# EasyEDA Pro project ProPrj_FOC一体化驱动控制板-L6234_2025-07-28.epro

# Schematic Schematic1
Board Name: Board1; Create Date: 2025-06-25; Page Name: P1; Project Name: FOC一体化驱动控制板-L6234; Schematic Name: Schematic1; Update Date: 2025-06-26; Company: 嘉立创EDA; Page Size: A4; Version: V1.0
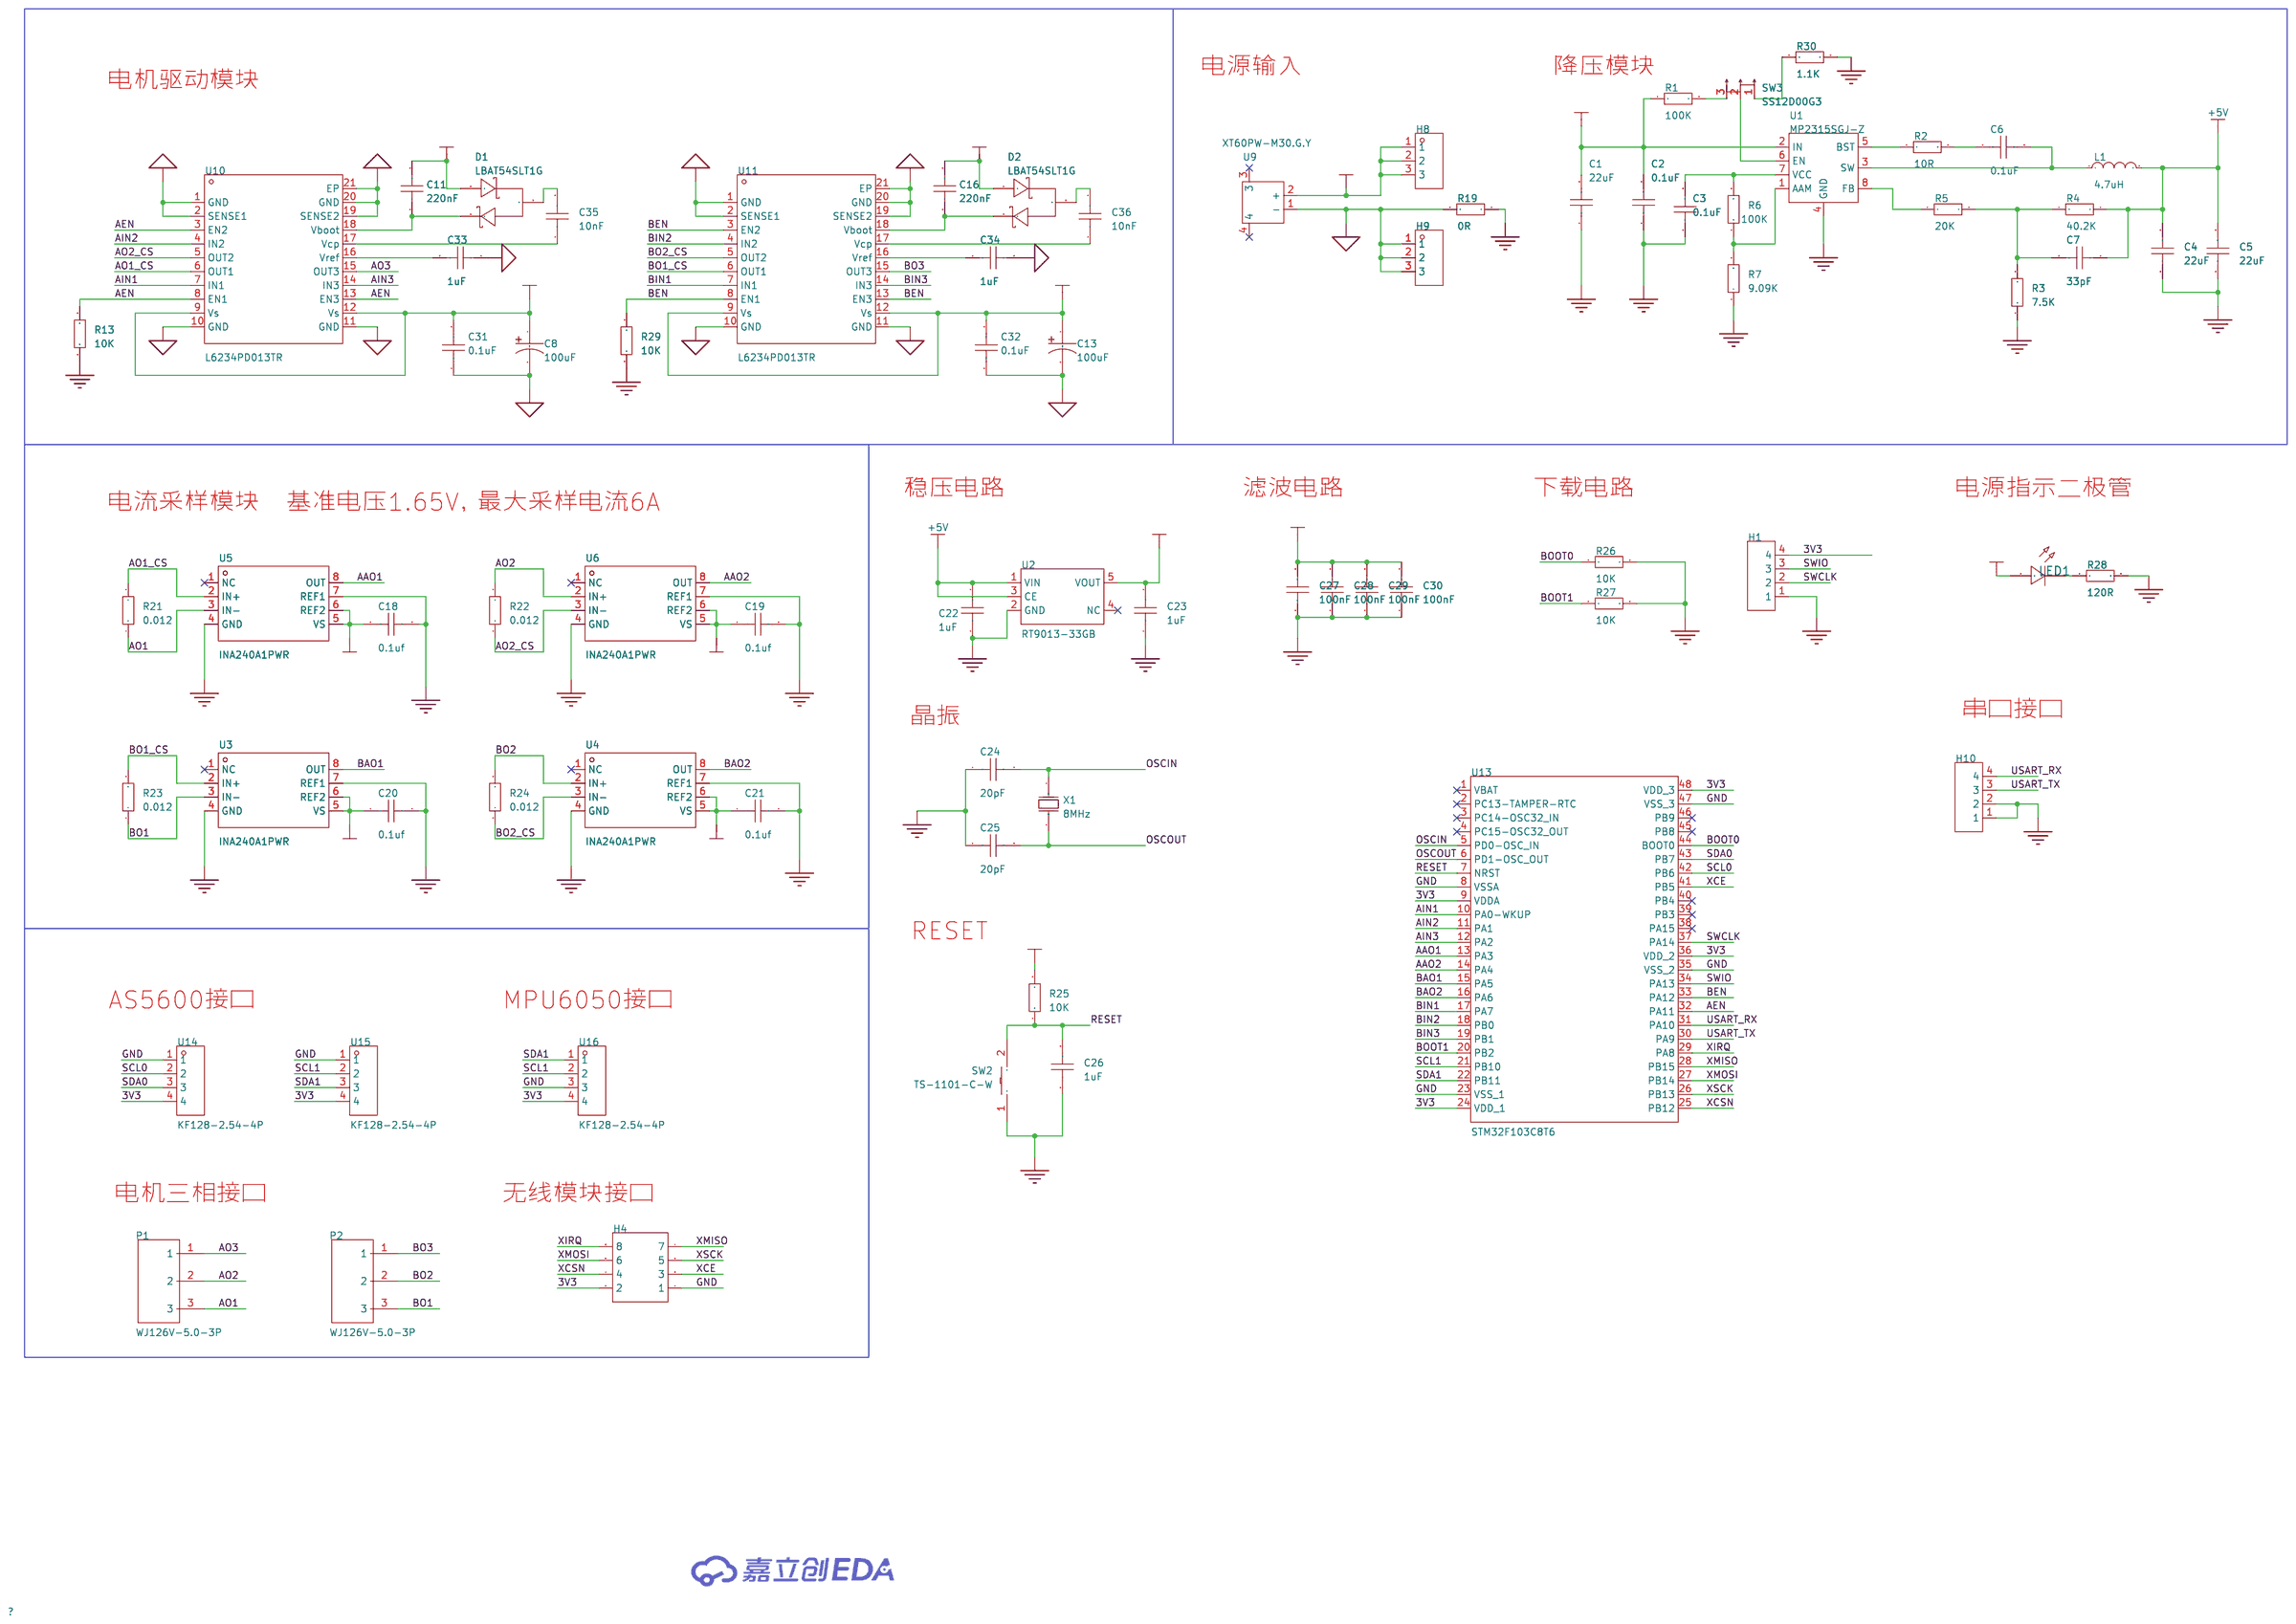
[diagram p0: schematic sheet]

## Parts
C1  22uF  [C1206]
C2  0.1uF  [C0603]
C3  0.1uF  [C0603]
C4  22uF  [C0805]
C5  22uF  [C0805]
C6  0.1uF  [C0603]
C7  33pF  [C0603]
C8  100uF  [CAP-SMD_BD6.3-L6.6-W6.6-FD]
C11  220nF  [C0805]
C13  100uF  [CAP-SMD_BD6.3-L6.6-W6.6-FD]
C16  220nF  [C0805]
C18  0.1uf  [C0603]
C19  0.1uf  [C0603]
C20  0.1uf  [C0603]
C21  0.1uf  [C0603]
C22  1uF  [C0603]
C23  1uF  [C0603]
C24  20pF  [C0603]
C25  20pF  [C0603]
C26  1uF  [C0603]
C27  100nF  [C0603]
C28  100nF  [C0603]
C29  100nF  [C0603]
C30  100nF  [C0603]
C31  0.1uF  [C0603]
C32  0.1uF  [C0603]
C33  1uF  [C0603]
C34  1uF  [C0603]
C35  10nF  [C0603]
C36  10nF  [C0603]
D1  LBAT54SLT1G  [SOT-23_L2.9-W1.3-P1.90-LS2.4-BR]
D2  LBAT54SLT1G  [SOT-23_L2.9-W1.3-P1.90-LS2.4-BR]
H1  -  [HDR-TH_4P-P2.54-V-M]
H4  -  [HDR-TH_8P-P2.54-V-F-R2-C4-S2.54-1]
H8  -  [HDR-TH_3P-P2.54-V-M]
H9  -  [HDR-TH_3P-P2.54-V-M]
H10  -  [HDR-TH_4P-P2.54-V-M]
L1  4.7uH  [IND-SMD_L7.3-W6.6]
LED1  -  [LED_0603]
P1  WJ126V-5.0-3P  [CONN-TH_3P-P5.00_WJ126V-5.0-3P]
P2  WJ126V-5.0-3P  [CONN-TH_3P-P5.00_WJ126V-5.0-3P]
R1  100K  [R0603]
R2  10R  [R0603]
R3  7.5K  [R0603]
R4  40.2K  [R0603]
R5  20K  [R0603]
R6  100K  [R0603]
R7  9.09K  [R0603]
R13  10K  [R0603]
R19  0R  [R0805]
R21  0.012  [R0805]
R22  0.012  [R0805]
R23  0.012  [R0805]
R24  0.012  [R0805]
R25  10K  [R0603]
R26  10K  [R0603]
R27  10K  [R0603]
R28  120R  [R0603]
R29  10K  [R0603]
R30  1.1K  [R0603]
SW2  TS-1101-C-W  [SW-SMD_L6.0-W3.3-LS8.0]
SW3  SS12D00G3  [SW-TH_SS-12D01-GX]
U1  MP2315SGJ-Z  [TSOT-23-8_L2.9-W1.6-P0.65-LS2.8-BL]
U2  RT9013-33GB  [SOT-23-5_L2.9-W1.6-P0.95-LS2.8-BR]
U3  INA240A1PWR  [TSSOP-8_L4.4-W3.0-P0.65-LS6.4-BL]
U4  INA240A1PWR  [TSSOP-8_L4.4-W3.0-P0.65-LS6.4-BL]
U5  INA240A1PWR  [TSSOP-8_L4.4-W3.0-P0.65-LS6.4-BL]
U6  INA240A1PWR  [TSSOP-8_L4.4-W3.0-P0.65-LS6.4-BL]
U9  XT60PW-M30.G.Y  [CONN-TH_XT60PW-M]
U10  L6234PD013TR  [POWERSO20_L15.9-W11.0-P1.27-LS14.2-BL-EP]
U11  L6234PD013TR  [POWERSO20_L15.9-W11.0-P1.27-LS14.2-BL-EP]
U13  STM32F103C8T6  [LQFP-48_L7.0-W7.0-P0.50-LS9.0-BL]
U14  KF128-2.54-4P  [CONN-TH_4P-P2.54_KF128-2.54-4P]
U15  KF128-2.54-4P  [CONN-TH_4P-P2.54_KF128-2.54-4P]
U16  KF128-2.54-4P  [CONN-TH_4P-P2.54_KF128-2.54-4P]
X1  8MHz  [OSC-TH_L10.0-W4.5-P5.00]

## Library data of the parts
C1 = CGA1206X5R226M350NT: 容值:22uF;精度:±20%;额定电压:35V;温度系数:X5R;; LCSC Part Name: 22uF ±20% 35V; Supplier Part: C6119969; Manufacturer: HRE(芯声); Supplier Footprint: 1206; JLCPCB Part Class: Extended Part; Supplier: LCSC; Tolerance: ±20%; Voltage Rating: 35V; Temperature Coefficient: X5R
C2 C3 C6 C7 C18-C36 = CAP_0603: Supplier Footprint: 0603
C4 C5 = CGA0805X5R226M350MT: 容值:22uF;精度:±20%;额定电压:35V;材质(温度系数):X5R;; LCSC Part Name: 22uF ±20% 35V; Supplier Part: C6119901; Manufacturer: HRE(芯声); Supplier Footprint: 0805; JLCPCB Part Class: Extended Part; Datasheet: https://atta.szlcsc.com/upload/public/pdf/source/20231129/D589D0CC4D260F7AC3A77E53B455CCB3.pdf; Supplier: LCSC; Tolerance: ±20%; Voltage Rated: 35V; Temperature Coefficient: X5R
C8 C13 = RVE1V101M0607: 容值:100uF;精度:±20%;额定电压:35V;纹波电流:-;等效串联电阻:-;; LCSC Part Name: 100uF ±20% 35V; Supplier Part: C88675; Manufacturer: HONOR(荣誉); Supplier Footprint: SMD,D6.3xL7.7mm; JLCPCB Part Class: 扩展库; Datasheet: https://atta.szlcsc.com/upload/public/pdf/source/20180326/C88681_F49340D40E14C975B06CFC1ADD63F7A4.pdf; Supplier: LCSC; Tolerance: ±20%; Rated Voltage: 35V; φD: 6.3mm; L: 7.7mm; Lifetime @ Temp: 2000hrs@105℃; Operating Temperature: -55℃~+105℃
C11 C16 = CAP_0805: Supplier Footprint: 0805
D1 D2 = LBAT54SLT1G: 正向压降(Vf):400mV;直流反向耐压(Vr):30V;整流电流:200mA;; LCSC Part Name: 电压:30V 电流:200mA; Supplier Part: C12765; Manufacturer: LRC(乐山无线电); Supplier Footprint: SOT-23; JLCPCB Part Class: 扩展库; Datasheet: https://atta.szlcsc.com/upload/public/pdf/source/20130604/1457706606553.pdf; Supplier: LCSC; Voltage - Forward(Vf@If): 400mV; Voltage - DC Reverse(Vr): 30V; Current - Rectified: 200mA; Reverse Leakage Current (Ir): 2uA
H1 H10 = HDR-M_2.54_1x4P: Supplier Part: C492403; Supplier Footprint: 插件
H4 = HDR-F_2.54_2x4: Supplier Part: C92271; Supplier Footprint: 插件; JLCPCB Part Class: 扩展库
H8 H9 = HDR-M_2.54_1x3P: Supplier Part: C2937625; Supplier Footprint: 插件
L1 = MCS0630-4R7MPY1: 电感值:4.7uH;精度:±20%;额定电流:5.5A;饱和电流(Isat):7A;; LCSC Part Name: 4.7uH ±20% 7A; Supplier Part: C2937097; Manufacturer: PSA(信昌电陶); Supplier Footprint: 0630; JLCPCB Part Class: 扩展库; Datasheet: https://atta.szlcsc.com/upload/public/pdf/source/20220121/EA6E6E6F70ED7BAE67EC293805EAAACB.pdf; Supplier: LCSC; Tolerance: ±20%; Rated Current: 5.5A; Saturation Current (Isat): 7A; DC Resistance (DCR): 37mΩ
LED1 = LED_0603-R: Supplier Footprint: 0603
P1 P2 = WJ126V-5.0-3P: 结构:1x3P;间距:5mm;颜色:绿色;安装方式:直插;额定电流:18A;额定电压:250V;排数:1;线规 - AWG:14~26;线规 - 平方毫米:2.5;每排PIN数:3;工作温度范围:-40℃~+105℃;; LCSC Part Name: 5mm 1x3P 排数:1 每排P数:3 直插; Supplier Part: C8401; Manufacturer: KANGNEX(康奈克斯电气); Supplier Footprint: 插件,P=5mm; JLCPCB Part Class: 扩展库; Datasheet: https://atta.szlcsc.com/upload/public/pdf/source/20191225/C8401_BC4AEF85CCBF7CDF5CCE64583ADD1E63.pdf; Supplier: LCSC; Structure: 1x3P; Pitch: 5mm; Color: 绿色; Mounting Style: 直插; Current Rating (Max): 18A; Voltage Rating (Max): 250V; Number of Pins: 3P; Number of Rows: 1; Wire Gauge - AWG: 14~26; Wire Gauge - mm2: 2.5; Number of PINs Per Row: 3; Operating Temperature Range: -40℃~+105℃
R1-R7 R13 R25-R30 = Res_0603: Supplier Footprint: 0603
R19 R21-R24 = Res_0805: Supplier Footprint: 0805
SW2 = TS-1101-C-W: 电路结构:单刀单掷;按钮形状:矩形按钮;作用力:260gf;安装方式:立贴;开关长度:6mm;开关宽度:3.6mm;开关高度:2.5mm;带支架:不带;触点电流:50mA;额定电压(AC):-;额定电压(DC):12V;额定功率:-;绝缘电阻:-;带灯:无;机械寿命:5万次;; LCSC Part Name: 6*3.6*2.5mm 立贴 轻触开关; Supplier Part: C318938; Manufacturer: XKB Connectivity(中国星坤); Supplier Footprint: SMD; JLCPCB Part Class: 扩展库; Datasheet: https://atta.szlcsc.com/upload/public/pdf/source/20200227/C318938_C2E53B1EEDE37D980A33616AC086DE53.pdf; Supplier: LCSC; Circuit: 单刀单掷; Actuator Style: 矩形按钮; Operating Force: 260gf; Mounting Style: 立贴; Switch Length: 6mm; Switch Width: 3.6mm; Switch Height: 2.5mm; Strike Gundam: 不带; Contact Current: 50mA; Voltage Rating (DC): 12V; Actuator/Cap Color: 白色带淡绿; With Lamp: 无; Mechanical Life: 5万次; Operating Temperature: -30℃~+85℃
SW3 = SS12D00G3: Supplier Part: C9900018735; Supplier Footprint: SW-TH; JLCPCB Part Class: 扩展库; Supplier: LCSC
U1 = MP2315SGJ-Z: 功能类型:降压型;输出类型:固定;工作电压:4.5V~24V;输出电压:800mV~22.8V;输出电流:3A;; LCSC Part Name: 3A、24V、500kHz高效同步降压转换器; Supplier Part: C3031493; Manufacturer: MPS(芯源); Supplier Footprint: TSOT-23-8; JLCPCB Part Class: 扩展库; Datasheet: https://atta.szlcsc.com/upload/public/pdf/source/20250306/6947E43CF096EA5EF0087E1884EF0D8F.pdf; Supplier: LCSC; Function: 降压型; Output Type: 固定; Voltage - Supply: 4.5V~24V; Output Voltage: 800mV~22.8V; Output Current: 3A; Frequency - Switching: 500kHz; Operating Temperature: -40℃~+125℃; Synchronous Rectifier: 是; Number of Outputs: 1; Topology: 降压式; Quiescent Current: 120uA; Switch tube (built-in/external): 内置
U2 = RT9013-33GB_C19268157: 输出类型:固定;工作电压:7V;输出电压:3.3V;输出电流:500mA;电源纹波抑制比(PSRR):-;输出极性:正极;; Supplier Part: C19268157; Manufacturer: TECH PUBLIC(台舟); Supplier Footprint: SOT-23-5; JLCPCB Part Class: 扩展库; Datasheet: https://atta.szlcsc.com/upload/public/pdf/source/20231201/9D78CA17020D67EC103F1AC7C29CF260.pdf; Supplier: LCSC; Output Type: 固定; Voltage - Supply: 7V; Output Voltage: 3.3V; Output Current: 500mA; Operating Temperature: -40℃~+85℃@(Ta); Output Configuration: 正极; Number of Outputs: 1
U3-U6 = INA240A2PWR: 放大器数:单路;; Supplier Part: C129949; Manufacturer: TI(德州仪器); Supplier Footprint: TSSOP-8; JLCPCB Part Class: 扩展库; Datasheet: https://www.ti.com/cn/lit/gpn/ina240; Supplier: LCSC; Number of Channels: 单路; Supply Current: 1.8mA; Operating Temperature: -40℃~+125℃
U9 = XT60PW-M30.G.Y: Supplier Part: C7204007; Supplier Footprint: 插件; JLCPCB Part Class: 扩展库; Supplier: LCSC
U10 U11 = L6234PD013TR: 三相电机驱动器; LCSC Part Name: 4A 无刷直流BLDC电机驱动芯片 52V; Supplier Part: C77581; Manufacturer: ST(意法半导体); Supplier Footprint: SOIC-20-EP-11mm; JLCPCB Part Class: 扩展库; Datasheet: https://atta.szlcsc.com/upload/public/pdf/source/20160702/1467448307879.pdf; Supplier: LCSC
U13 = STM32F103C8T6: CPU内核:ARM-M3;CPU最大主频:72MHz;应用领域:-;; LCSC Part Name: 主流增强型ARM Cortex-M3 MCU，具有64 KB Flash、72 MHz CPU、电机控制、USB和CAN; Supplier Part: C8734; Manufacturer: ST(意法半导体); Supplier Footprint: LQFP-48(7x7); JLCPCB Part Class: 扩展库; Datasheet: https://atta.szlcsc.com/upload/public/pdf/source/20220812/8363ACEC51AD55ECEB84799464F7CB85.pdf; Supplier: LCSC; CPU Core: ARM-M3; CPU Maximum Speed: 72MHz; Program Storage Size: 64KB; Program Memory Type: FLASH; Number of I/O: 37; ADC (Bit): 12bit; Low Voltage Detection Threshold: 2V~3.6V
U14-U16 = KF128-2.54-4P: 结构:1x4P;间距:2.54mm;颜色:绿色;安装方式:直插;额定电流:8A;额定电压:130V;排数:1;线规 - AWG:18~26;线规 - 平方毫米:1;每排PIN数:4;工作温度范围:-40℃~+105℃;; LCSC Part Name: 2.54mm 1x4P 排数:1 每排P数:4 直插; Supplier Part: C474922; Manufacturer: KEFA(科发); Supplier Footprint: 插件,P=2.54mm; JLCPCB Part Class: 扩展库; Datasheet: https://atta.szlcsc.com/upload/public/pdf/source/20230317/0E5ECA9DB49110BC3219D12632CEA6EE.pdf; Supplier: LCSC; Structure: 1x4P; Pitch: 2.54mm; Color: 绿色; Mounting Style: 直插; Current Rating (Max): 8A; Voltage Rating (Max): 130V; Number of Pins: 4P; Number of Rows: 1; Wire Gauge - AWG: 18~26; Wire Gauge - mm2: 1; Number of PINs Per Row: 4; Operating Temperature Range: -40℃~+105℃
X1 = X49SD8MSD2SC: 晶振类型:直插晶振;频率:8MHz;常温频差:±20ppm;负载电容:20pF;频率稳定度:±30ppm;; LCSC Part Name: 8MHz ±20ppm 20pF; Supplier Part: C21263; Manufacturer: YXC(扬兴晶振); Supplier Footprint: HC-49S; JLCPCB Part Class: Extended Part; Datasheet: https://atta.szlcsc.com/upload/public/pdf/source/20240329/977D7F2434F98B2BE33270BB9FF3D86D.pdf; Supplier: LCSC; Type: 直插晶振; Normal temperature Frequency Tolerance: ±20ppm; Load Capacitance: 20pF; Frequency Stability: ±30ppm; Operating Temperature: -20℃~+70℃

## Nets
3V3: C18.1 C19.1 C20.1 C21.1 C23.2 C27.2 C28.2 C29.2 C30.2 H1.4 H4.2 LED1.2(A) R25.2 U2.5(VOUT) U3.5(VS) U3.6(REF2) U4.5(VS) U4.6(REF2) U5.5(VS) U5.6(REF2) U6.5(VS) U6.6(REF2) U13.9(VDDA) U13.24(VDD_1) U13.36(VDD_2) U13.48(VDD_3) U14.4 U15.4 U16.4
+5V: C4.2 C5.2 C7.2 C22.2 L1.2 R4.2 U2.1(VIN) U2.3(CE)
AGND: C8.2 C13.2 C31.1 C32.1 C33.1 C34.1 H9.1 H9.2 H9.3 R19.2 U9.1(-) U10.1(GND) U10.2(SENSE1) U10.10(GND) U10.11(GND) U10.19(SENSE2) U10.20(GND) U10.21(EP) U11.1(GND) U11.2(SENSE1) U11.10(GND) U11.11(GND) U11.19(SENSE2) U11.20(GND) U11.21(EP)
GND: C1.1 C2.1 C3.1 C4.1 C5.1 C18.2 C19.2 C20.2 C21.2 C22.1 C23.1 C24.1 C25.1 C26.1 C27.1 C28.1 C29.1 C30.1 H1.1 H4.1 H10.1 H10.2 R3.1 R7.1 R13.1 R19.1 R26.2 R27.2 R28.2 R29.1 R30.2 SW2.1 U1.4(GND) U2.2(GND) U3.4(GND) U3.7(REF1) U4.4(GND) U4.7(REF1) U5.4(GND) U5.7(REF1) U6.4(GND) U6.7(REF1) U13.8(VSSA) U13.23(VSS_1) U13.35(VSS_2) U13.47(VSS_3) U14.1 U15.1 U16.3
VIN: C1.2 C2.2 C8.1 C11.2 C13.1 C16.2 C31.2 C32.2 D1.1(A) D2.1(A) H8.1 H8.2 H8.3 R1.1 U1.2(IN) U9.2(+) U10.9(Vs) U10.12(Vs) U11.9(Vs) U11.12(Vs)
AAO1: U5.8(OUT) U13.13(PA3)
AAO2: U6.8(OUT) U13.14(PA4)
AEN: R13.2 U10.3(EN2) U10.8(EN1) U10.13(EN3) U13.32(PA11)
AIN1: U10.7(IN1) U13.10(PA0-WKUP)
AIN2: U10.4(IN2) U13.11(PA1)
AIN3: U10.14(IN3) U13.12(PA2)
AO1: P1.3 R21.1 U5.3(IN-)
AO1_CS: R21.2 U5.2(IN+) U10.6(OUT1)
AO2: P1.2 R22.2 U6.2(IN+)
AO2_CS: R22.1 U6.3(IN-) U10.5(OUT2)
AO3: P1.1 U10.15(OUT3)
BAO1: U3.8(OUT) U13.15(PA5)
BAO2: U4.8(OUT) U13.16(PA6)
BEN: R29.2 U11.3(EN2) U11.8(EN1) U11.13(EN3) U13.33(PA12)
BIN1: U11.7(IN1) U13.17(PA7)
BIN2: U11.4(IN2) U13.18(PB0)
BIN3: U11.14(IN3) U13.19(PB1)
BO1: P2.3 R23.1 U3.3(IN-)
BO1_CS: R23.2 U3.2(IN+) U11.6(OUT1)
BO2: P2.2 R24.2 U4.2(IN+)
BO2_CS: R24.1 U4.3(IN-) U11.5(OUT2)
BO3: P2.1 U11.15(OUT3)
BOOT0: R26.1 U13.44(BOOT0)
BOOT1: R27.1 U13.20(PB2)
OSCIN: C24.2 U13.5(PD0-OSC_IN) X1.1(OSC1)
OSCOUT: C25.2 U13.6(PD1-OSC_OUT) X1.2(OSC2)
RESET: C26.2 R25.1 SW2.2 U13.7(NRST)
SCL0: U13.42(PB6) U14.2
SCL1: U13.21(PB10) U15.2 U16.2
SDA0: U13.43(PB7) U14.3
SDA1: U13.22(PB11) U15.3 U16.1
SWCLK: H1.2 U13.37(PA14)
SWIO: H1.3 U13.34(PA13)
USART_RX: H10.4 U13.31(PA10)
USART_TX: H10.3 U13.30(PA9)
XCE: H4.3 U13.41(PB5)
XCSN: H4.4 U13.25(PB12)
XIRQ: H4.8 U13.29(PA8)
XMISO: H4.7 U13.28(PB15)
XMOSI: H4.6 U13.27(PB14)
XSCK: H4.5 U13.26(PB13)
$1N1058: C33.2 U10.16(Vref)
$1N1061: C11.1 D1.2(K) U10.18(Vboot)
$1N1062: C35.2 D1.3(AK)
$1N1063: C35.1 U10.17(Vcp)
$1N1088: C34.2 U11.16(Vref)
$1N1091: C16.1 D2.2(K) U11.18(Vboot)
$1N1092: C36.2 D2.3(AK)
$1N1093: C36.1 U11.17(Vcp)
$1N3100: C6.2 L1.1 U1.3(SW)
$1N3102: R2.1 U1.5(BST)
$1N3103: C6.1 R2.2
$1N3104: C7.1 R3.2 R4.1 R5.2
$1N3106: R5.1 U1.8(FB)
$1N3110: C3.2 R6.2 U1.7(VCC)
$1N3113: R6.1 R7.2 U1.1(AAM)
$1N4579: LED1.1(C) R28.1
$1N5379: R1.2 SW3.3
$1N5466: R30.1 SW3.1
$1N5477: SW3.2 U1.6(EN)

Not connected (* = marked no-connect by the designer): U2 4(NC)*; U3 1(NC)*; U4 1(NC)*; U5 1(NC)*; U6 1(NC)*; U9 3* 4*; U13 1(VBAT)* 2(PC13-TAMPER-RTC)* 3(PC14-OSC32_IN)* 4(PC15-OSC32_OUT)* 38(PA15)* 39(PB3)* 40(PB4)* 45(PB8)* 46(PB9)*

## Notes on the sheet
- 电源输入
- 降压模块
- 电机驱动模块
- 稳压电路
- 滤波电路
- 下载电路
- 电源指示二极管
- 电流采样模块  基准电压1.65V，最大采样电流6A
- 晶振
- 串口接口
- RESET
- AS5600接口
- MPU6050接口
- 电机三相接口
- 无线模块接口

# Board PCB1
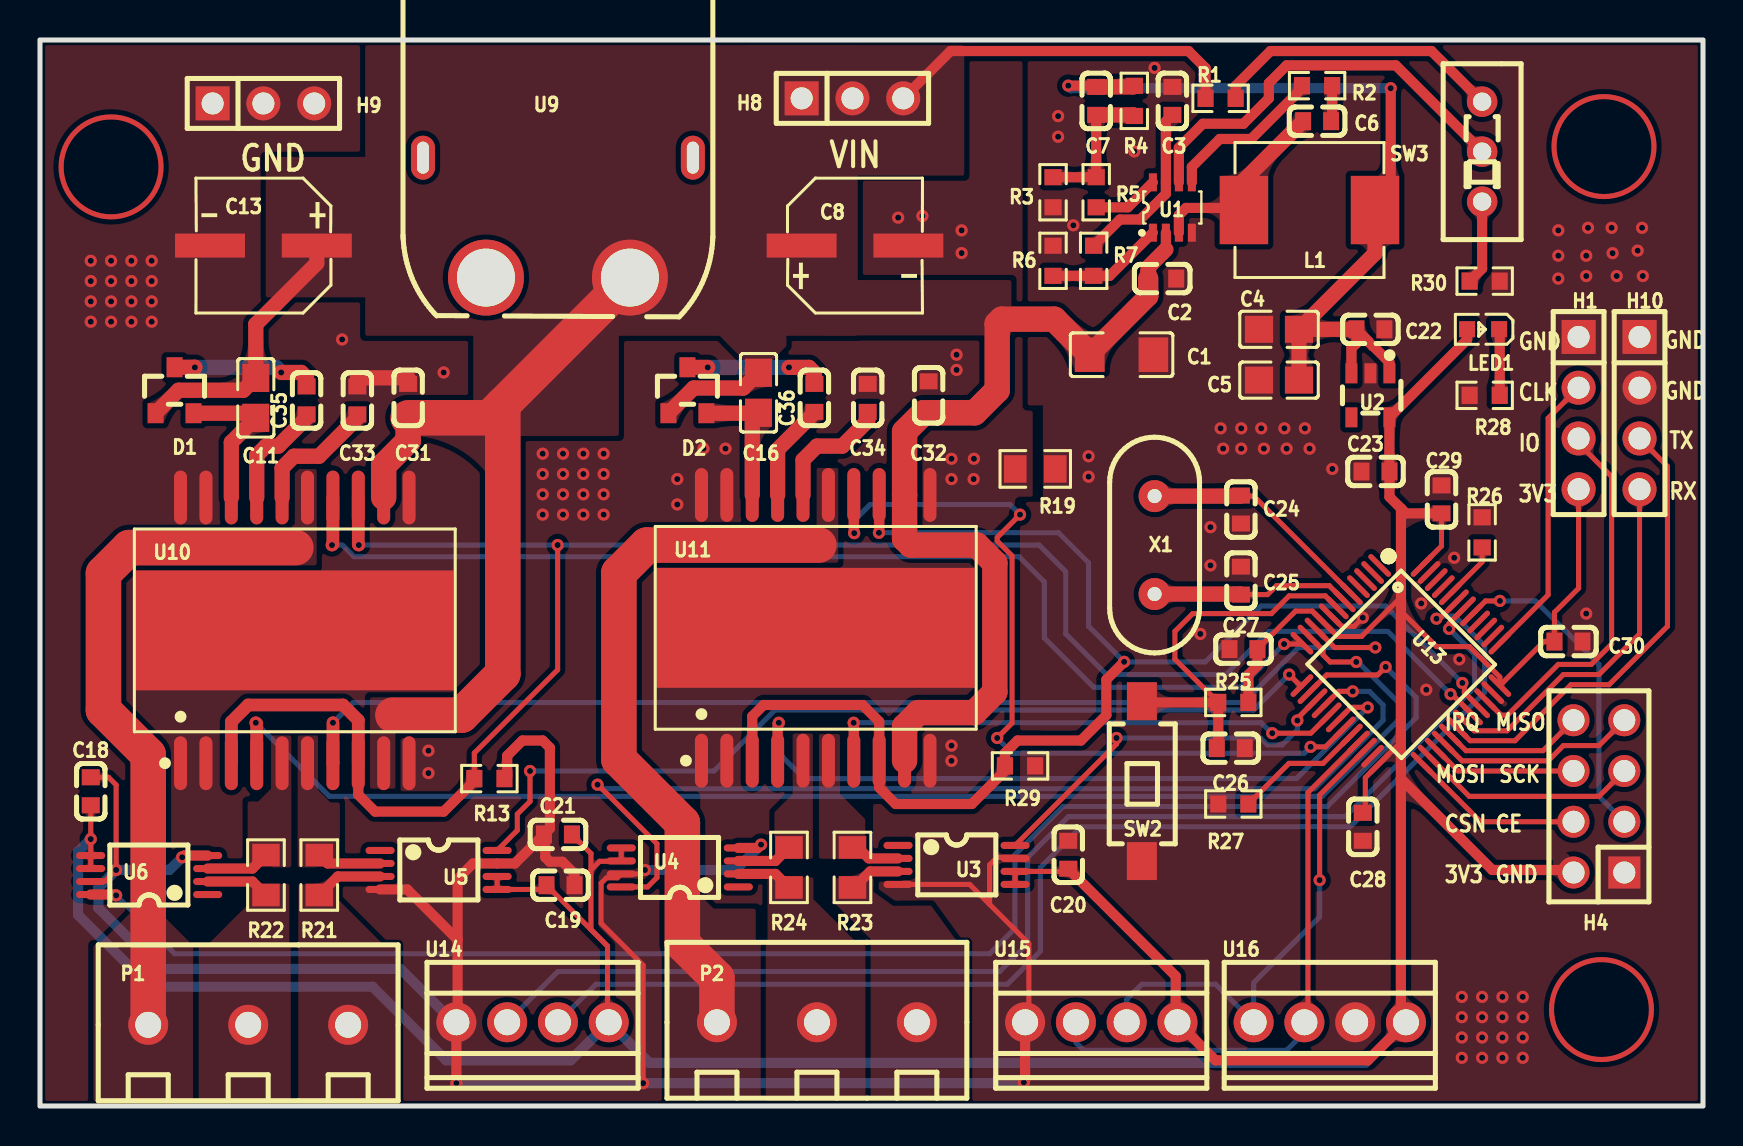
[diagram p1: board, top side]
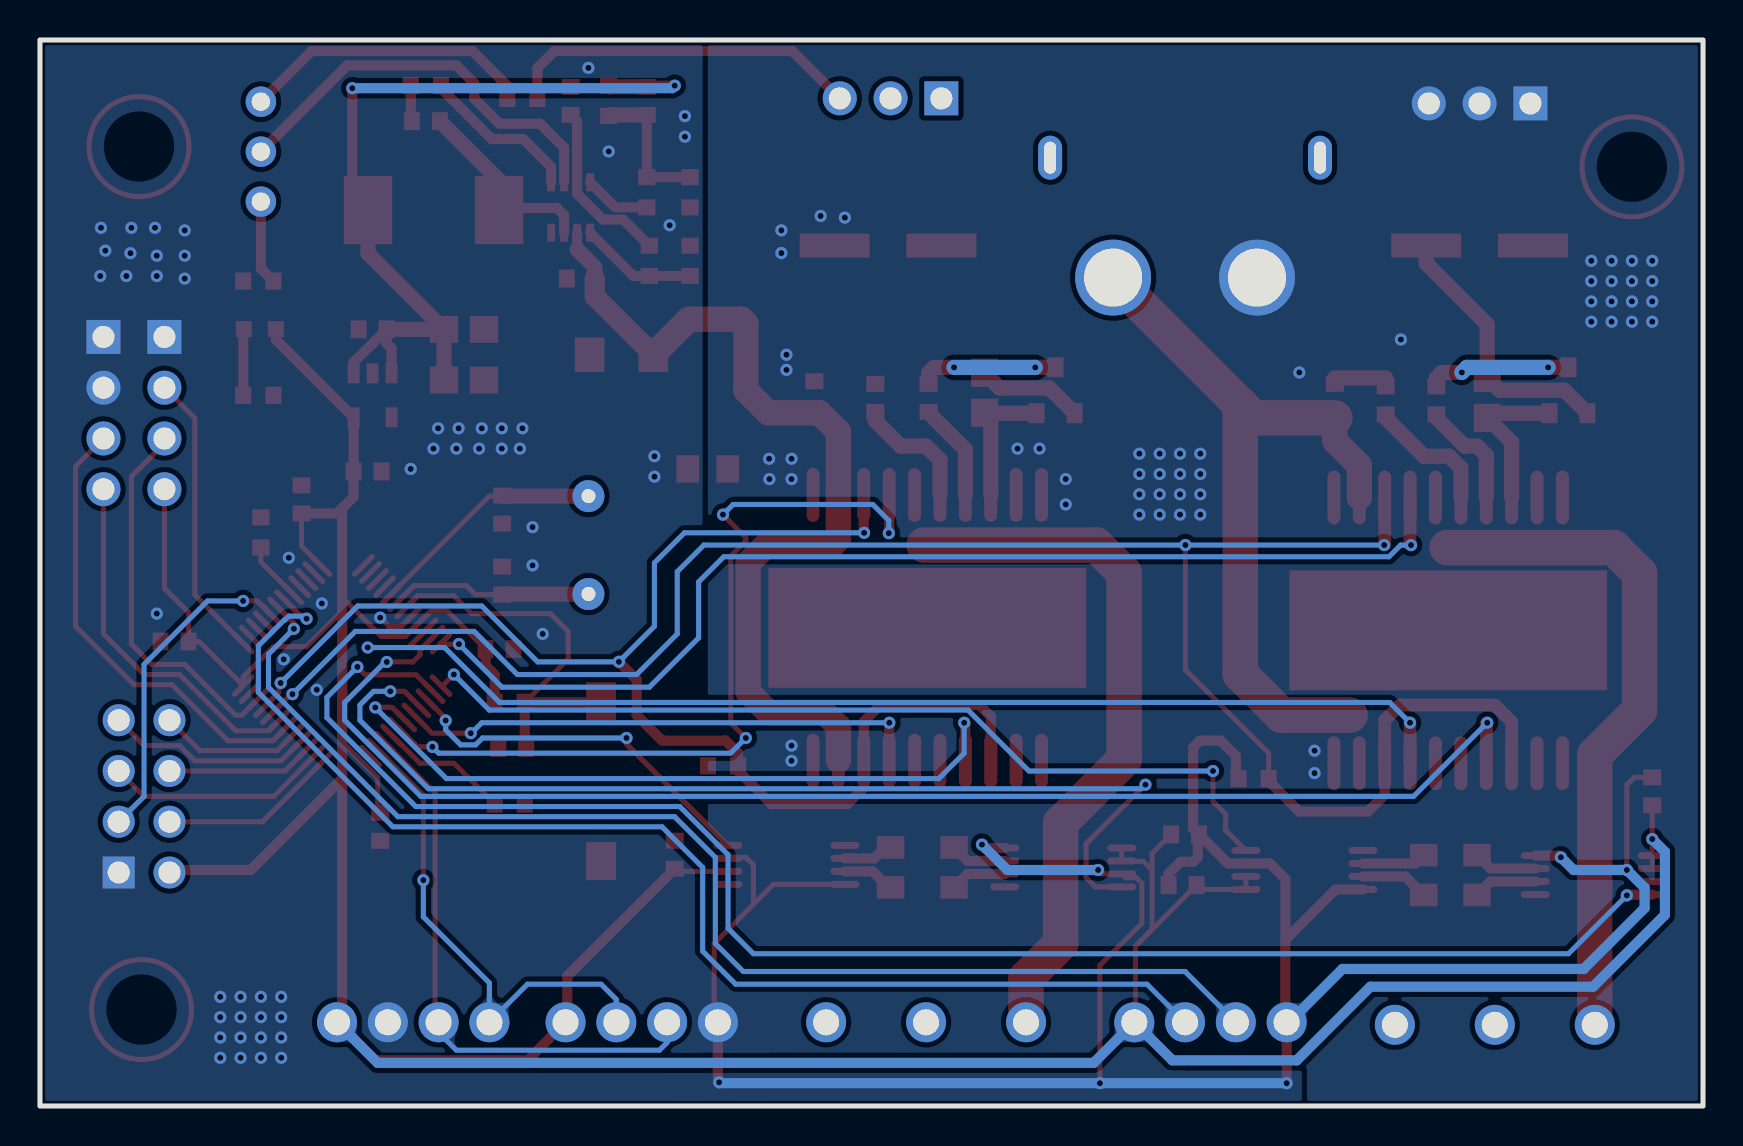
[diagram p2: board, bottom side, seen from below]

Outline 83.19 x 53.34 mm; copper layers: Top Layer, Inner1, Inner2, Bottom Layer. Coordinates in mm from the lower left corner of the outline.
Outline path: rectangle 0,53.34 83.19,0
Stack: Top Layer 0.035mm 外层铜厚1oz / Dielectric1 0.2104mm 7628 RC49% 8.6mil / Inner1 0.0152mm 内层铜厚 / Dielectric2 1.065mm 1.1mm H/HOZ Copper / Inner2 0.0152mm 内层铜厚 / Dielectric3 0.2104mm 7628 RC49% 8.6mil / Bottom Layer 0.035mm 外层铜厚1oz

## Design rules (mm)
template: 自定义配置
spacing copperThickness1oz (default): track to track 0.102, other pairs 0.152 to 0.3
spacing copperThickness2oz: track to track 0.203, other pairs 0.152 to 0.3
track width copperThickness1oz (default): min 0.127, default 0.254, max 2.54
track width copperThickness2oz: min 0.203, default 0.254, max 2.54
differential pair differentialPair (default): width min 0.127, default 0.254, max 2.54; gap min 0.152, default 0.152
via viaSize (default): diameter min 0.5, default 0.61, max 10; hole min 0.3, default 0.305, max 6.3

## Placement (name value [footprint] x y rotation side)
C1  22uF  [C1206]  54.1 37.59 180 top
C2  0.1uF  [C0603]  56.13 41.4 180 top
C3  0.1uF  [C0603]  56.64 50.29 270 top
C4  22uF  [C0805]  61.98 38.86 0 top
C5  22uF  [C0805]  61.98 36.32 0 top
C6  0.1uF  [C0603]  63.88 49.28 180 top
C7  33pF  [C0603]  52.83 50.29 90 top
C8  100uF  [CAP-SMD_BD6.3-L6.6-W6.6-FD]  40.77 43.05 0 top
C11  220nF  [C0805]  10.8 35.43 90 top
C13  100uF  [CAP-SMD_BD6.3-L6.6-W6.6-FD]  11.18 43.05 180 top
C16  220nF  [C0805]  35.94 35.69 90 top
C18  0.1uf  [C0603]  2.54 15.75 90 top
C19  0.1uf  [C0603]  26.04 11.05 0 top
C20  0.1uf  [C0603]  51.44 12.57 90 top
C21  0.1uf  [C0603]  25.91 13.59 180 top
C22  1uF  [C0603]  66.55 38.86 180 top
C23  1uF  [C0603]  66.8 31.75 0 top
C24  20pF  [C0603]  60.07 29.84 90 top
C25  20pF  [C0603]  60.07 26.29 270 top
C26  1uF  [C0603]  59.56 17.91 180 top
C27  100nF  [C0603]  60.2 22.86 0 top
C28  100nF  [C0603]  66.17 13.97 90 top
C29  100nF  [C0603]  70.1 30.35 270 top
C30  100nF  [C0603]  76.45 23.24 180 top
C31  0.1uF  [C0603]  18.42 35.43 270 top
C32  0.1uF  [C0603]  44.45 35.56 270 top
C33  1uF  [C0603]  15.88 35.31 270 top
C34  1uF  [C0603]  41.4 35.43 270 top
C35  10nF  [C0603]  13.34 35.31 90 top
C36  10nF  [C0603]  38.73 35.43 90 top
D1  LBAT54SLT1G  [SOT-23_L2.9-W1.3-P1.90-LS2.4-BR]  6.73 35.81 270 top
D2  LBAT54SLT1G  [SOT-23_L2.9-W1.3-P1.90-LS2.4-BR]  32.39 35.81 270 top
H1  -  [HDR-TH_4P-P2.54-V-M]  76.96 34.67 270 top
H4  -  [HDR-TH_8P-P2.54-V-F-R2-C4-S2.54-1]  77.98 15.49 90 top
H8  -  [HDR-TH_3P-P2.54-V-M]  40.64 50.42 0 top
H9  -  [HDR-TH_3P-P2.54-V-M]  11.18 50.17 0 top
H10  -  [HDR-TH_4P-P2.54-V-M]  80.01 34.67 270 top
L1  4.7uH  [IND-SMD_L7.3-W6.6]  63.5 44.83 180 top
LED1  -  [LED_0603]  72.14 38.86 180 top
P1  WJ126V-5.0-3P  [CONN-TH_3P-P5.00_WJ126V-5.0-3P]  10.41 4.06 180 top
P2  WJ126V-5.0-3P  [CONN-TH_3P-P5.00_WJ126V-5.0-3P]  38.86 4.19 180 top
R1  100K  [R0603]  59.05 50.42 0 top
R2  10R  [R0603]  63.88 51.05 0 top
R3  7.5K  [R0603]  50.67 45.72 90 top
R4  40.2K  [R0603]  54.74 50.29 90 top
R5  20K  [R0603]  52.83 45.72 90 top
R6  100K  [R0603]  52.7 42.29 90 top
R7  9.09K  [R0603]  50.67 42.29 270 top
R13  10K  [R0603]  22.48 16.38 180 top
R19  0R  [R0805]  49.78 31.88 180 top
R21  0.012  [R0805]  13.97 11.56 90 top
R22  0.012  [R0805]  11.3 11.56 270 top
R23  0.012  [R0805]  40.64 11.94 90 top
R24  0.012  [R0805]  37.46 11.94 270 top
R25  10K  [R0603]  59.69 20.19 0 top
R26  10K  [R0603]  72.14 28.7 90 top
R27  10K  [R0603]  59.69 15.11 180 top
R28  120R  [R0603]  72.26 35.56 180 top
R29  10K  [R0603]  49.02 17.02 180 top
R30  1.1K  [R0603]  72.26 41.28 0 top
SW2  TS-1101-C-W  [SW-SMD_L6.0-W3.3-LS8.0]  55.12 16.26 90 top
SW3  SS12D00G3  [SW-TH_SS-12D01-GX]  72.14 47.75 90 top
U1  MP2315SGJ-Z  [TSOT-23-8_L2.9-W1.6-P0.65-LS2.8-BL]  56.64 44.96 0 top
U2  RT9013-33GB  [SOT-23-5_L2.9-W1.6-P0.95-LS2.8-BR]  66.55 35.56 90 top
U3  INA240A1PWR  [TSSOP-8_L4.4-W3.0-P0.65-LS6.4-BL]  45.85 12.06 270 top
U4  INA240A1PWR  [TSSOP-8_L4.4-W3.0-P0.65-LS6.4-BL]  32 11.94 90 top
U5  INA240A1PWR  [TSSOP-8_L4.4-W3.0-P0.65-LS6.4-BL]  19.94 11.81 270 top
U6  INA240A1PWR  [TSSOP-8_L4.4-W3.0-P0.65-LS6.4-BL]  5.46 11.56 90 top
U9  XT60PW-M30.G.Y  [CONN-TH_XT60PW-M]  25.91 44.45 270 top
U10  L6234PD013TR  [POWERSO20_L15.9-W11.0-P1.27-LS14.2-BL-EP]  12.75 23.8 0 top
U11  L6234PD013TR  [POWERSO20_L15.9-W11.0-P1.27-LS14.2-BL-EP]  38.8 23.93 0 top
U13  STM32F103C8T6  [LQFP-48_L7.0-W7.0-P0.50-LS9.0-BL]  68.07 22.1 225 top
U14  KF128-2.54-4P  [CONN-TH_4P-P2.54_KF128-2.54-4P]  24.64 4.19 0 top
U15  KF128-2.54-4P  [CONN-TH_4P-P2.54_KF128-2.54-4P]  53.09 4.19 0 top
U16  KF128-2.54-4P  [CONN-TH_4P-P2.54_KF128-2.54-4P]  64.52 4.19 0 top
X1  8MHz  [OSC-TH_L10.0-W4.5-P5.00]  55.75 28.07 0 top

## Footprints (pads in the part's own frame, mm; a bottom-side part is the same pattern mirrored in y, then rotated)
C0603
  rect 0.8x0.9 smd: 1(-0.7,0) 2(0.7,0)
C0805
  rect 1.41x1.35 smd: 1(-1,0) 2(1,0)
C1206
  rect 1.485x1.728 smd: 1(-1.593,0) 2(1.593,0)
CAP-SMD_BD6.3-L6.6-W6.6-FD
  rect 3.5x1.2 smd: 1(-2.67,0) 2(2.67,0)
CONN-TH_3P-P5.00_WJ126V-5.0-3P
  round 2 hole 1.3: 1(5,0) 2(-0.002,0) 3(-5,0)
CONN-TH_4P-P2.54_KF128-2.54-4P
  round 2 hole 1.3: 1(-3.81,0) 2(-1.27,0) 3(1.27,0) 4(3.81,0)
CONN-TH_XT60PW-M
  round 3.8 hole 2.9: 1(3,-3.6) 2(3,3.6)
  oval 2.2x1.2 hole 1.6x0.6: 3(-3,6.75) 4(-3,-6.75)
HDR-TH_3P-P2.54-V-M
  rect 1.7x1.7 hole 1.1: 1(-2.54,0)
  round 1.7 hole 1.1: 2(0,0) 3(2.54,0)
HDR-TH_4P-P2.54-V-M
  rect 1.7x1.7 hole 1.1: 1(-3.81,0)
  round 1.7 hole 1.1: 2(-1.27,0) 3(1.27,0) 4(3.81,0)
HDR-TH_8P-P2.54-V-F-R2-C4-S2.54-1
  rect 1.6x1.6 hole 1.1: 1(-3.81,-1.27)
  round 1.6 hole 1.1: 2(-3.81,1.27) 3(-1.27,-1.27) 4(-1.27,1.27) 5(1.27,-1.27) 6(1.27,1.27) 7(3.81,-1.27) 8(3.81,1.27)
IND-SMD_L7.3-W6.6
  rect 2.424x3.42 smd: 1(3.278,0) 2(-3.278,0)
LED_0603
  rect 0.8x0.8 smd: 1(-0.851,-0.01) 2(0.75,-0.005)
LQFP-48_L7.0-W7.0-P0.50-LS9.0-BL
  oval 0.27x1.5 smd: 1(-2.75,-4.25) 2(-2.25,-4.25) 3(-1.75,-4.25) 4(-1.25,-4.25) 5(-0.75,-4.25) 6(-0.25,-4.25) 7(0.25,-4.25) 8(0.75,-4.25) 9(1.25,-4.25) 10(1.75,-4.25) 11(2.25,-4.25) 12(2.75,-4.25) 25(2.75,4.25) 26(2.25,4.25) 27(1.75,4.25) 28(1.25,4.25) 29(0.75,4.25) 30(0.25,4.25) 31(-0.25,4.25) 32(-0.75,4.25) 33(-1.25,4.25) 34(-1.75,4.25) 35(-2.25,4.25) 36(-2.75,4.25)
  oval 1.5x0.27 smd: 13(4.25,-2.75) 14(4.25,-2.25) 15(4.25,-1.75) 16(4.25,-1.25) 17(4.25,-0.75) 18(4.25,-0.25) 19(4.25,0.25) 20(4.25,0.75) 21(4.25,1.25) 22(4.25,1.75) 23(4.25,2.25) 24(4.25,2.75) 37(-4.25,2.75) 38(-4.25,2.25) 39(-4.25,1.75) 40(-4.25,1.25) 41(-4.25,0.75) 42(-4.25,0.25) 43(-4.25,-0.25) 44(-4.25,-0.75) 45(-4.25,-1.25) 46(-4.25,-1.75) 47(-4.25,-2.25) 48(-4.25,-2.75)
OSC-TH_L10.0-W4.5-P5.00
  round 1.6 hole 0.7: 1(0,2.45) 2(0,-2.45)
POWERSO20_L15.9-W11.0-P1.27-LS14.2-BL-EP
  oval 0.651x2.696 smd: 1(-5.715,-6.647) 2(-4.445,-6.647) 3(-3.175,-6.647) 4(-1.905,-6.647) 5(-0.635,-6.647) 6(0.635,-6.647) 7(1.905,-6.647) 8(3.175,-6.647) 9(4.445,-6.647) 10(5.715,-6.647) 11(5.715,6.647) 12(4.445,6.647) 13(3.175,6.647) 14(1.905,6.647) 15(0.635,6.647) 16(-0.635,6.647) 17(-1.905,6.647) 18(-3.175,6.647) 19(-4.445,6.647) 20(-5.715,6.647)
  rect 15.9x6 smd: 21(0,0)
R0603
  rect 0.806x0.864 smd: 1(-0.753,0) 2(0.753,0)
R0805
  rect 1.133x1.377 smd: 1(-1,0) 2(1,0)
SOT-23-5_L2.9-W1.6-P0.95-LS2.8-BR
  rect 1x0.6 smd: 1(1.1,-0.95) 2(1.1,0) 3(1.1,0.95) 4(-1.1,0.95) 5(-1.1,-0.95)
SOT-23_L2.9-W1.3-P1.90-LS2.4-BR
  rect 1x0.8 smd: 1(1.15,-0.95) 2(1.15,0.95) 3(-1.15,0)
SW-SMD_L6.0-W3.3-LS8.0
  rect 1.9x1.5 smd: 1(-4,0) 2(4,0)
SW-TH_SS-12D01-GX
  round 1.524 hole 0.914: 1(-2.5,0) 2(0,0) 3(2.5,0)
TSOT-23-8_L2.9-W1.6-P0.65-LS2.8-BL
  rect 0.4x0.9 smd: 1(-0.975,-1.26) 2(-0.325,-1.26) 3(0.325,-1.26) 4(0.975,-1.26) 5(0.975,1.26) 6(0.325,1.26) 7(-0.325,1.26) 8(-0.975,1.26)
TSSOP-8_L4.4-W3.0-P0.65-LS6.4-BL
  oval 0.353x1.454 smd: 1(-0.975,-2.927) 2(-0.325,-2.927) 3(0.325,-2.927) 4(0.975,-2.927) 5(0.975,2.927) 6(0.325,2.927) 7(-0.325,2.927) 8(-0.975,2.927)

## Nets
As in the schematic.

Pads without a net: U2 4; U3 1; U4 1; U5 1; U6 1; U9 3 4; U13 1 2 3 4 38 39 40 45 46

## Via types
v1: diameter 0.61, hole 0.305, Top Layer to Bottom Layer, 153 vias

## Routing (per net, layer and track width the routed paths; a pad name or vN(x,y) marks a point on that pad's centre or on a via; arc(x,y) is an arc through that point)
3V3: length 212.8
  Top Layer w0.254: C21.1 27.56,12.64 27.56,11.81 ; 28.39,8 28.39,4.25 U14.4 ; 28.39,8 27.56,8.83 27.56,11.81 ; 28.39,8 28.38,8 C19.1 25.12,10.84 U5.5 U5.6 ; U3.5 U3.6 51.3,11.74 C20.1 ; C29.2 70.1,28.02 U13.48 ; H1.4 76.96,25.91 75.75,24.7 C30.2 75.23,23.24 U13.36 73.02,21.47 71.5,22.99 69.85,22.99 68.08,24.77 ; 27.56,11.81 27.99,12.24 29.06,12.24 U4.6 U4.5 ; 68.07,18.21 U13.24 66.29,16.43 66.29,14.8 C28.2 ; C27.2 62.8,24.77 63.64,24.77 U13.9 64.91,23.5 66.11,23.5 68.08,25.47 ; C18.1 v1(2.54,13.36) 2.54,12.54 U6.5 U6.6
  Top Layer w0.508: R25.2 60.44,21.58 60.9,22.04 C27.2 ; 76.71,11.68 76.58,11.81 72.64,11.81 68.07,16.38 ; C29.2 68.33,29.65 68.08,29.9 ; 68.07,16.38 68.07,4.45 U16.4 66.42,2.29 58.8,2.29 U15.4 56.81,4.28 56.81,6.5 C20.1 ; 68.07,16.38 68.07,24.7 ; 68.08,29.9 67.5,30.48 C23.2 67.5,31.75 U2.5 71.39,38.35 LED1.2 ; 68.08,29.9 68.08,24.77
  Bottom Layer w0.508: v1(2.54,13.36) 1.91,12.72 1.91,9.56 5.5,5.97 16.64,5.97 20.32,2.29 26.54,2.29 U14.4 30.48,2.16 66.29,2.16 U16.4
+5V: length 44.1
  Top Layer w0.508: v1(51.44,51.05) 52.77,51.05 C7.2 ; U2.1 67.5,37.21 66.7,38.01 66.68,38.01 66.44,38.24 66.44,38.27 C22.2 65.85,38.16 65.6,37.91 65.6,36.66 ; v1(67.56,50.93) 67.56,45.62 L1.2
  Top Layer w0.762: C7.2 54.68,50.99 R4.2 ; C4.2 C5.2 ; C4.2 66.78,42.66 L1.2 ; C4.2 C22.2
  Bottom Layer w0.508: v1(67.56,50.93) 51.56,50.93 v1(51.44,51.05)
AGND: length 2.5
  Top Layer w0.762: 18.42,36.43 15.88,36.43
  vias: v1(2.54,42.29) v1(2.54,41.28) v1(2.54,40.26) v1(2.54,39.24) v1(3.56,42.29) v1(3.56,41.28) v1(3.56,40.26) v1(3.56,39.24) v1(4.57,42.29) v1(4.57,41.28) v1(4.57,40.26) v1(4.57,39.24) v1(5.59,42.29) v1(5.59,41.28) v1(5.59,40.26) v1(5.59,39.24) v1(15.11,38.35) v1(19.43,17.78) v1(19.43,16.66) v1(20.19,36.7) v1(25.15,32.64) v1(25.15,31.62) v1(25.15,30.61) v1(25.15,29.59) v1(26.16,32.64) v1(26.16,31.62) v1(26.16,30.61) v1(26.16,29.59) v1(27.18,32.64) v1(27.18,31.62) v1(27.18,30.61) v1(27.18,29.59) v1(28.19,32.64) v1(28.19,31.62) v1(28.19,30.61) v1(28.19,29.59) v1(31.88,31.37) v1(31.88,30.1) v1(33.19,32.89) v1(34.29,32.89) v1(42.93,44.45) v1(44.14,44.53) v1(45.59,32.39) v1(45.59,31.37) v1(45.59,18.03) v1(45.59,17.27) v1(45.85,37.59) v1(45.85,36.83) v1(46.1,43.81) v1(46.1,42.68) v1(46.71,32.39) v1(46.7,31.37)
GND: length 136.4
  Top Layer w0.254: U3.7 48.72,12.45 47.88,12.45 47.5,12.06 47.5,10.09 ; U13.8 65.11,24 65.73,24 v1(66.17,24.44) ; U15.1 49.46,4.38 49.46,8.13 47.5,10.09 ; v1(30.26,11.81) 30.06,11.61 U4.7 28.88,11.42 28.34,11.42 28.07,11.15 28.07,9.14 30.17,7.04 v1(30.17,1.14) ; C18.2 3.43,16.45 3.81,16.07 v1(3.81,11.81) 3.23,11.23 U6.7 ; 47.5,10.09 46.5,11.09 U3.4
  Top Layer w0.508: U5.4 18.37,10.84 20.89,8.32 ; C21.2 25.51,13.89 25.51,17.93 25.15,18.29 24.13,18.29 23.37,17.53 23.37,16.52 R13.1 ; C21.2 23.76,12.14 U5.7 21.66,12.14 20.89,11.36 20.89,8.32 ; C21.2 25.27,13.52 25.27,12.45 25.5,12.22 26.13,12.22 26.73,11.62 C19.2 ; 20.89,8.32 20.89,4.25 20.83,4.19 v1(20.83,1.14) ; U4.4 35.9,12.91 v1(36.07,13.08) ; U15.1 49.28,1.25 v1(49.21,1.19) ; U6.4 7.2,12.53 v1(7.11,12.45)
  Bottom Layer w0.508: v1(49.21,1.19) 49.17,1.14 v1(30.17,1.14) v1(20.83,1.14) ; 20.83,4.19 20.7,4.19 18.03,6.86 5.97,6.86 2.92,9.91 2.92,10.92 v1(3.81,11.81) 6.48,11.81 v1(7.11,12.45) ; v1(36.07,13.08) 34.8,11.81 v1(30.26,11.81)
  vias: v1(50.93,49.53) v1(50.93,48.5) v1(51.69,44.07) v1(52.45,32.51) v1(52.45,31.49) v1(54.74,47.76) v1(55.75,51.94) v1(58.04,23.62) v1(58.55,28.96) v1(58.55,27.05) v1(59.05,33.91) v1(59.18,32.89) v1(60.09,33.91) v1(60.09,32.89) v1(61.09,33.91) v1(61.22,32.89) v1(62.25,33.91) v1(62.36,32.89) v1(63.27,33.91) v1(63.5,32.89) v1(64.64,31.88) v1(69.09,25.15) v1(69.34,20.83) v1(70.74,27.43) v1(70.99,22.35) v1(71.12,5.46) v1(71.12,4.45) v1(71.12,3.43) v1(71.12,2.41) v1(72.14,5.46) v1(72.14,4.45) v1(72.14,3.43) v1(72.14,2.41) v1(73.15,5.46) v1(73.15,4.45) v1(73.15,3.43) v1(73.15,2.41) v1(74.17,5.46) v1(74.17,4.45) v1(74.17,3.43) v1(74.17,2.41) v1(75.95,43.81) v1(75.95,42.55) v1(75.95,41.4) v1(77.34,42.55) v1(77.34,41.53) v1(77.34,24.64) v1(77.43,43.94) v1(78.61,43.94) v1(78.66,42.67) v1(78.87,41.53) v1(79.92,42.8) v1(80.14,43.94) v1(80.17,41.53)
VIN: length 121
  Top Layer w0.508: R1.1 58.3,51.93 57.45,52.79 45.55,52.79 H8.3 ; 56.32,42.86 U1.2
  Top Layer w0.762: D2.1 32.7,35.92 35.18,35.92 C16.2 ; C13.1 13.85,42.17 10.8,39.12 C11.2 10.18,35.81 6.93,35.81 D1.1 ; 55.43,41.43 55.43,41.97 56.32,42.86
  Top Layer w1.016: C1.2 55.43,40.52 C2.2
  Top Layer w1.27: 18.42,34.43 18.42,33.27 17.19,32.05 U10.12 ; C1.2 50.73,39.37 48.11,39.37 47.88,39.14 47.88,35.81 46.75,34.69 44.2,34.69 43.25,33.74 U11.12 43.25,28.38 43.56,28.07 46.86,28.07 47.76,27.17 47.76,20.71 46.74,19.69 43.94,19.69 43.25,18.99 U11.9
  Top Layer w1.778: 17.65,19.56 21.08,19.56 23.15,21.63 23.15,35.09 ; U9.2 23.15,35.09 ; 23.15,35.09 22.49,34.43 18.42,34.43
AAO1: length 45.5
  Top Layer w0.254: v1(62.48,21.59) 63.04,21.04 U13.13 ; U5.8 23.88,13.8 23.88,14.61 24.51,15.24 v1(24.51,16.76)
  Bottom Layer w0.254: v1(24.51,16.76) 33.72,16.76 36.77,19.81 60.71,19.81 v1(62.48,21.59)
AAO2: length 82.1
  Top Layer w0.254: v1(67.31,21.97) 66.91,21.57 64.36,21.57 63.48,20.68
  Top Layer w0.508: v1(3.81,10.54) 3.77,10.58 U6.8
  Bottom Layer w0.254: v1(67.31,21.97) 68.83,20.45 68.83,19.43 64.39,14.99 51.18,14.99 48.77,12.57 48.77,8.89 47.5,7.62 6.73,7.62 v1(3.81,10.54)
AEN: length 98.3
  Top Layer w0.254: R13.2 21.73,17.66 25.89,21.83 v1(25.89,28.07) ; U13.32 70.62,20.61 v1(70.56,20.61)
  Top Layer w0.508: U10.8 15.92,15.57 16.76,14.73 20.19,14.73 21.73,16.26 R13.2
  Top Layer w0.635: U10.8 15.92,19.3 15.16,20.07 10.41,20.07 9.57,19.22 U10.3 ; v1(15.95,28.07) 15.92,28.09 U10.13
  Bottom Layer w0.254: v1(70.56,20.61) 67.41,23.75 61.47,23.75 59.31,21.59 53.34,21.59 51.31,23.62 51.31,26.74 49.98,28.07 v1(25.89,28.07) v1(15.95,28.07)
AIN1: length 59.1
  Top Layer w0.254: U13.10 64.75,22.94 v1(66.79,22.94)
  Top Layer w0.635: U10.7 14.66,17.16 v1(14.66,19.18)
  Bottom Layer w0.254: v1(14.66,19.18) 15.67,20.19 60.2,20.19 62.95,22.94 v1(66.79,22.94)
AIN2: length 69.2
  Top Layer w0.254: v1(65.84,22.22) 64.53,22.22 64.18,22.57 64.18,22.81 63.48,23.51
  Top Layer w0.635: v1(10.8,19.18) 10.84,19.13 U10.4
  Bottom Layer w0.254: v1(65.84,22.22) 65.92,22.22 67.95,20.19 67.95,19.3 64.14,15.49 14.48,15.49 v1(10.8,19.18)
AIN3: length 56.4
  Top Layer w0.254: v1(62.23,23.11) 63.08,23.11 U13.12
  Top Layer w0.635: v1(14.61,28.07) 14.65,28.11 U10.14
  Bottom Layer w0.254: v1(14.61,28.07) 15.12,28.07 15.71,27.48 48.98,27.48 50.24,26.22 50.24,23.42 52.7,20.95 60.07,20.95 v1(62.23,23.11)
AO1: length 3.4
  Top Layer w0.508: R21.1 14.9,11.49 U5.3
AO1_CS: length 3.2
  Top Layer w0.508: U5.2 14.39,12.14 R21.2
AO2: length 3.2
  Top Layer w0.508: U6.2 10.63,11.23 R22.2
AO2_CS: length 3.2
  Top Layer w0.508: U6.3 10.63,11.88 R22.1
AO3: length 33.7
  Top Layer w1.778: 12.8,27.94 4.46,27.94 3.17,26.65 3.17,19.81 5.41,17.57 P1.1
BAO1: length 18.9
  Top Layer w0.254: 48.77,13.04 53.85,18.11 v1(53.85,18.42) ; v1(62.89,19.29) 62.89,19.39 U13.15
  Bottom Layer w0.254: 61.05,18.41 61.4,18.07 62.14,18.07 62.89,18.82 v1(62.89,19.29) ; 61.05,18.42 v1(53.85,18.42)
BAO2: length 53
  Top Layer w0.254: U13.16 64.95,20.75 v1(65.67,20.75) ; U4.8 30.39,10.96 30.86,11.43 30.86,13.12 27.9,16.08
  Bottom Layer w0.254: v1(27.89,16.08) 28.09,15.88 63.75,15.88 67.18,19.3 67.18,20.07 66.5,20.75 v1(65.67,20.75)
BEN: length 69.4
  Top Layer w0.254: U13.33 71.25,20.69 71.25,21.07 v1(71.15,21.17)
  Top Layer w0.508: v1(54.23,22.22) 53.34,21.34 53.34,19.56 52.07,18.29 48.89,18.29 48.27,17.66 R29.2 48.27,16.77 46.61,15.11 42.8,15.11 41.98,15.93 U11.8 41.98,19.24 41.15,20.07 36.2,20.07 35.63,19.5 U11.3 ; v1(41.96,28.68) 41.98,28.69 U11.13
  Bottom Layer w0.254: v1(71.15,21.17) 67.3,25.02 61.09,25.02 58.29,22.22 v1(54.23,22.22) 52.45,24 52.45,27.18 50.95,28.68 v1(41.96,28.68)
BIN1: length 26.4
  Top Layer w0.254: v1(61.64,18.66) 63.57,18.66 U13.17
  Top Layer w0.508: v1(40.7,19.18) 40.71,19.17 U11.7
  Bottom Layer w0.254: v1(61.64,18.66) 61.61,18.66 61.09,19.18 v1(40.7,19.18)
BIN2: length 36.7
  Top Layer w0.254: v1(66.41,19.94) 66.41,19.95 65.69,19.95 65.68,19.94 65.56,19.94 64.89,19.27
  Top Layer w0.508: v1(36.96,19.18) 36.9,19.12 U11.4
  Bottom Layer w0.254: v1(36.96,19.18) 36.96,17.65 38.23,16.38 62.86,16.38 v1(66.41,19.94)
BIN3: length 41.9
  Top Layer w0.254: v1(63.56,17.97) 64.3,17.97 U13.19 ; v1(47.88,18.42) 48.63,19.16 48.63,27.53 47.88,28.27 47.88,28.45 v1(49.02,29.59)
  Top Layer w0.508: U11.14 40.71,28.68 v1(40.73,28.66)
  Bottom Layer w0.254: v1(47.88,18.42) 48.64,17.65 63.24,17.65 v1(63.56,17.97) ; v1(49.02,29.59) 48.51,30.1 41.53,30.1 40.73,29.3 v1(40.73,28.66)
BO1: length 2.7
  Top Layer w0.508: 40.64,10.81 40.64,10.85 41.53,11.74 U3.3
BO1_CS: length 2.5
  Top Layer w0.508: 40.64,12.81 41.04,12.81 41.46,12.39 U3.2
BO2: length 2.8
  Top Layer w0.508: U4.2 36.79,11.61 R24.2
BO2_CS: length 2.8
  Top Layer w0.508: U4.3 36.79,12.26 R24.1
BO3: length 35.1
  Top Layer w1.778: 38.96,28.07 30.35,28.07 28.96,26.67 28.96,17.34 32.13,14.17 32.13,8.13 33.86,6.4 P2.1
BOOT0: length 3
  Top Layer w0.254: R26.1 72.14,27.22 U13.44
BOOT1: length 6.6
  Top Layer w0.254: U13.20 64.18,17.14 62.48,17.14 R27.1
OSCIN: length 11.9
  Top Layer w0.254: 60.04,30.52 60.71,30.52 U13.5
  Top Layer w0.762: X1.1 60.04,30.52 C24.2
OSCOUT: length 10
  Top Layer w0.254: 65.24,25.28 64.49,26.03 61.85,26.03 61.4,25.59 C25.2
  Top Layer w0.762: X1.2 60.04,25.62 C25.2
RESET: length 19.7
  Top Layer w0.254: 64.89,24.93 64.29,25.53 62.48,25.53 61.6,24.64 57.66,24.64 56.77,23.75 56.77,22.36 R25.1
  Top Layer w0.508: SW2.2 55.18,20.19 R25.1 58.94,17.98 C26.2
SCL0: length 62.7
  Top Layer w0.254: v1(70.48,23.88) 70.48,24.16 U13.42
  Bottom Layer w0.254: v1(70.48,23.88) 71.76,22.61 71.76,20.95 65.28,14.48 51.44,14.48 49.4,12.44 49.4,8.13 48.01,6.73 25.91,6.73 23.37,4.19
SCL1: length 28.6
  Top Layer w0.254: U13.21 63.42,15.68 63.42,4.37 U16.2
  Bottom Layer w0.254: U15.2 51.82,3.17 52.2,2.79 62.36,2.79 63.25,3.68 U16.2
SDA0: length 62.5
  Top Layer w0.254: 70.9,25.28 70,24.38 v1(69.85,24.38)
  Bottom Layer w0.254: U14.3 27.81,6.1 48.39,6.1 50.04,7.75 50.04,11.94 52.07,13.97 65.53,13.97 72.26,20.7 72.26,23.03 70.97,24.32 70.93,24.32 70.74,24.51 69.98,24.51 v1(69.85,24.38)
SDA1: length 24.6
  Top Layer w0.254: v1(64.01,11.3) 64.01,15.56 U13.22
  Bottom Layer w0.254: U15.3 54.36,5.33 55.12,6.1 58.8,6.1 U16.1 60.71,6.16 64.01,9.47 v1(64.01,11.3)
SWCLK: length 14.4
  Top Layer w0.254: U13.37 75.44,25.58 75.44,34.42 H1.2
SWIO: length 19.1
  Top Layer w0.254: U13.34 73.09,19.56 73.41,19.56 75.95,22.1 77.6,22.1 78.61,23.11 78.61,31.5 76.96,33.15 H1.3
USART_RX: length 18.2
  Top Layer w0.254: H10.4 80.01,23.62 77.98,21.59 76.2,21.59 73.38,18.77 71.75,18.77 U13.31
USART_TX: length 23.1
  Top Layer w0.254: U13.30 71.54,18.28 73.78,18.28 76.58,21.08 78.49,21.08 81.41,24 81.41,32 H10.3
XCE: length 16.4
  Top Layer w0.254: U13.41 72.31,25.27 v1(73.02,25.27)
  Bottom Layer w0.254: H4.3 77.98,15.49 77.98,22.1 74.8,25.27 v1(73.02,25.27)
XCSN: length 8.8
  Top Layer w0.254: U13.25 72.06,14.22 76.71,14.22
XIRQ: length 7.1
  Top Layer w0.254: U13.29 71.33,17.78 75.18,17.78 76.71,19.3
XMISO: length 10.3
  Top Layer w0.254: H4.7 77.98,18.03 76.2,18.03 75.44,17.27 71.13,17.27 U13.28
XMOSI: length 7.3
  Top Layer w0.254: 76.71,16.76 70.93,16.76 U13.27
XSCK: length 11.1
  Top Layer w0.254: H4.5 77.98,15.49 71.49,15.49 69.49,17.5
$1N1058: length 6.3
  Top Layer w0.762: U10.16 12.11,31.92 12.7,32.51 13.95,32.51 15.88,34.43
$1N1061: length 7.7
  Top Layer w0.762: D1.2 10.56,34.66 C11.1 9.57,33.21 U10.18
$1N1062: length 6.8
  Top Layer w0.762: v1(12.06,36.7) 13.06,36.7 13.34,36.43 ; v1(7.75,36.96) 7.74,36.96 D1.3
  Bottom Layer w0.762: v1(12.06,36.7) 11.81,36.96 v1(7.75,36.96)
$1N1063: length 5.4
  Top Layer w0.762: 13.34,34.43 11.92,33.02 11.3,33.02 10.84,32.56 U10.17
$1N1088: length 6.2
  Top Layer w0.762: 41.4,34.69 41.4,34.29 40.13,33.02 38.86,33.02 38.17,32.33 U11.16
$1N1091: length 6.8
  Top Layer w0.762: 35.92,34.66 C16.1 ; 35.92,34.66 35.63,34.37 U11.18 ; 35.92,34.66 D2.2
$1N1092: length 7
  Top Layer w0.762: v1(33.4,36.96) 32.39,36.96 D2.3 ; C36.2 38.73,36.69 38.46,36.96 v1(37.46,36.96)
  Bottom Layer w0.762: v1(33.4,36.96) v1(37.46,36.96)
$1N1093: length 4.9
  Top Layer w0.762: U11.17 36.9,32.85 38.73,34.69
$1N3100: length 10
  Top Layer w0.508: 60.22,44.83 60.12,44.94 57.33,44.94 56.97,44.58 U1.3
  Top Layer w0.762: C6.2 60.22,46.32 60.22,44.83
$1N3102: length 8.1
  Top Layer w0.508: 63.25,51.05 60.59,48.39 59.01,48.39 57.62,46.99 U1.5
$1N3103: length 1.8
  Top Layer w0.508: R2.2 64.63,49.33 C6.1
$1N3104: length 7.2
  Top Layer w0.508: C7.1 R5.2 R3.2
  Top Layer w0.762: C7.1 54.68,49.59 R4.1
$1N3106: length 3.4
  Top Layer w0.508: U1.8 54.42,44.97 R5.1
$1N3110: length 8.8
  Top Layer w0.508: C3.2 56.32,49.27 U1.7 56.32,45.64 55.03,44.36 54.02,44.36 R6.2
$1N3113: length 5.9
  Top Layer w0.508: R7.2 R6.1 53.51,41.54 U1.1
$1N4579: length 3.3
  Top Layer w0.508: R28.1 73.02,38.84 LED1.1
$1N5379: length 14.7
  Top Layer w0.508: SW3.3 69.6,52.79 61.55,52.79 59.81,51.05 R1.2
$1N5466: length 4.2
  Top Layer w0.508: SW3.1 72.14,41.9 R30.1
$1N5477: length 20.8
  Top Layer w0.508: SW3.2 67.82,52.07 62.36,52.07 61.47,51.18 61.47,50.42 60.2,49.15 58.17,49.15 56.97,47.95 U1.6

## Copper pours and planes (outline as drawn; the poured copper is in the pictures)
AGND on Top Layer: -4.95,55.88 49.66,55.88 49.66,-3.3 -4.95,-3.3
AGND on Bottom Layer: -2.54,58.42 51.82,58.42 51.82,-7.11 -2.54,-7.11
AGND on Inner1: -3.3,59.94 51.69,59.94 51.69,-4.7 -3.3,-4.7
AGND on Inner2: -7.24,57.4 51.69,57.4 51.69,-3.3 -7.24,-3.3
GND on Top Layer: 49.4,56.64 84.84,56.64 84.84,35.05 49.4,35.05
GND on Top Layer: 50.17,35.81 87.38,35.81 87.38,-0.25 50.17,-0.25
GND on Top Layer: 49.02,30.23 56.01,30.23 56.01,-2.03 49.02,-2.03
GND on Top Layer: 14.93,15.49 32.77,15.49 32.77,-2.92 14.93,-2.92
GND on Top Layer: 41.67,15.11 53.47,15.11 53.47,-1.65 41.67,-1.65
GND on Top Layer: 48.75,29.32 51.68,29.32 51.68,17.65 48.75,17.65
GND on Bottom Layer: 46.61,7.62 51.82,7.62 51.82,-0.38 46.61,-0.38
GND on Bottom Layer: 20.07,1.78 48.39,1.78 48.39,-0.63 20.07,-0.63
GND on Bottom Layer: 50.04,57.15 89.15,57.15 89.15,-1.65 50.04,-1.65
GND on Bottom Layer: 25.78,6.1 49.21,6.1 49.21,0.94 25.78,0.94
GND on Inner1: 49.53,58.29 84.84,58.29 84.84,-1.65 49.53,-1.65
GND on Inner2: 49.53,57.53 86.36,57.53 86.36,-2.16 49.53,-2.16
VIN on Top Layer: 11.29,47.49 20.02,47.49 20.02,40.47 11.29,40.47
VIN on Top Layer: 16.27,53.39 40.9,53.39 40.9,38.54 16.27,38.54
VIN on Top Layer: 35.14,37.38 33.52,39.02 33.64,40.01 36.99,40.01 37.34,39.65 37.34,38.02 36.37,37.05 35.47,37.05
VIN on Top Layer: 16.51,20.45 17.78,20.45 17.78,15.88 16.51,15.88
VIN on Top Layer: 21.67,39.54 28.96,39.54 28.96,33.53 21.67,33.53
VIN on Top Layer: 35.43,53.31 46.23,53.31 46.23,46.55 35.43,46.55
VIN on Top Layer: 39.22,41.33 48.59,41.33 48.59,38.56 39.22,38.56
AO1 on Top Layer: 12.93,11.08 14.88,11.08 14.88,0.26 12.93,0.26
AO1 on Top Layer: 13.05,8.06 17.91,8.06 17.91,0.26 13.05,0.26
AO1 on Top Layer: 14.48,10.77 14.48,7.49 17.76,7.49
AO1_CS on Top Layer: 14.61,15.11 13.59,16.13 13.59,14.22 13.46,14.1 13.59,14.1
AO1_CS on Top Layer: 12.94,15.19 15,15.19 15,11.98 12.94,11.98
AO1_CS on Top Layer: 12.89,18.54 13.91,18.54 13.91,11.94 12.89,11.94
AO2 on Top Layer: 10.39,11.12 12.47,11.12 12.47,0.31 10.39,0.31
AO2 on Top Layer: 11.05,10.74 7.9,7.59 12.29,7.59 12.45,7.75 12.45,9.34
AO2 on Top Layer: 7.94,8.09 12.55,8.09 12.55,0.29 7.94,0.29
AO2_CS on Top Layer: 11.56,18.54 12.57,18.54 12.57,11.94 11.56,11.94
AO2_CS on Top Layer: 10.39,15.24 12.45,15.24 12.45,12.03 10.39,12.03
AO2_CS on Top Layer: 10.73,15.05 11.75,16.07 12.06,15.75 12.06,14.61 11.18,14.61
AO3 on Top Layer: 2.79,7.94 5.27,10.42 7.49,8.19 7.49,7.75 2.98,7.75
AO3 on Top Layer: 12.75,31.88 13.84,31.88 13.84,26.97 12.75,26.97
AO3 on Top Layer: 13.08,29.46 12.06,28.45 12.95,28.45 13.08,28.32
AO3 on Top Layer: 2.67,8.05 7.66,8.05 7.66,0.25 2.67,0.25
BO1 on Top Layer: 39.72,11.4 41.59,11.4 41.7,11.39 41.69,10.72 42.67,10.02 44.57,10.03 46.1,7.92 46.05,7.87 41.66,7.87 41.66,8.24 39.72,10.18
BO1 on Top Layer: 41.51,8.17 46.37,8.17 46.37,0.37 41.51,0.37
BO1_CS on Top Layer: 38.96,18.62 40.02,18.62 40.02,12.37 38.96,12.37
BO1_CS on Top Layer: 39.59,16.04 41.28,14.35 41.28,13.2 39.63,13.2 39.44,13.01 39.44,15.9
BO2 on Top Layer: 36.31,8.09 41.29,8.09 41.29,0.29 36.31,0.29
BO2 on Top Layer: 36.39,11.44 38.6,11.44 38.69,11.44 38.69,10.34 41.01,8.02 41.01,7.05 36.53,7.05 36.41,6.94 36.39,6.96
BO2_CS on Top Layer: 36.82,13.4 38.07,13.4 38.07,16.03 36.74,14.7 36.74,13.48
BO2_CS on Top Layer: 37.65,18.64 38.66,18.64 38.66,12.37 37.65,12.37
BO3 on Top Layer: 35.8,7.77 35.8,9.87 35.8,9.88 33.7,9.88 32.73,10.84 32.38,10.49 32.38,7.63 35.67,7.63
BO3 on Top Layer: 38.85,31.93 39.93,31.93 39.93,27.19 38.85,27.19
BO3 on Top Layer: 31.36,8.17 36.1,8.17 36.1,0.37 31.36,0.37

Small or netless copper shapes (teardrops, artwork), in the pictures only: 215 on Top Layer, 47 on Bottom Layer

## Text on the board
Top Silkscreen Layer: MOSI | IRQ | CSN | 3V3 | MISO | CE | GND | SCK | CLK | IO | TX | RX | VIN
